# Altium schematic sheet 02 BLOCK.SchDoc
size 420 x 297 mm
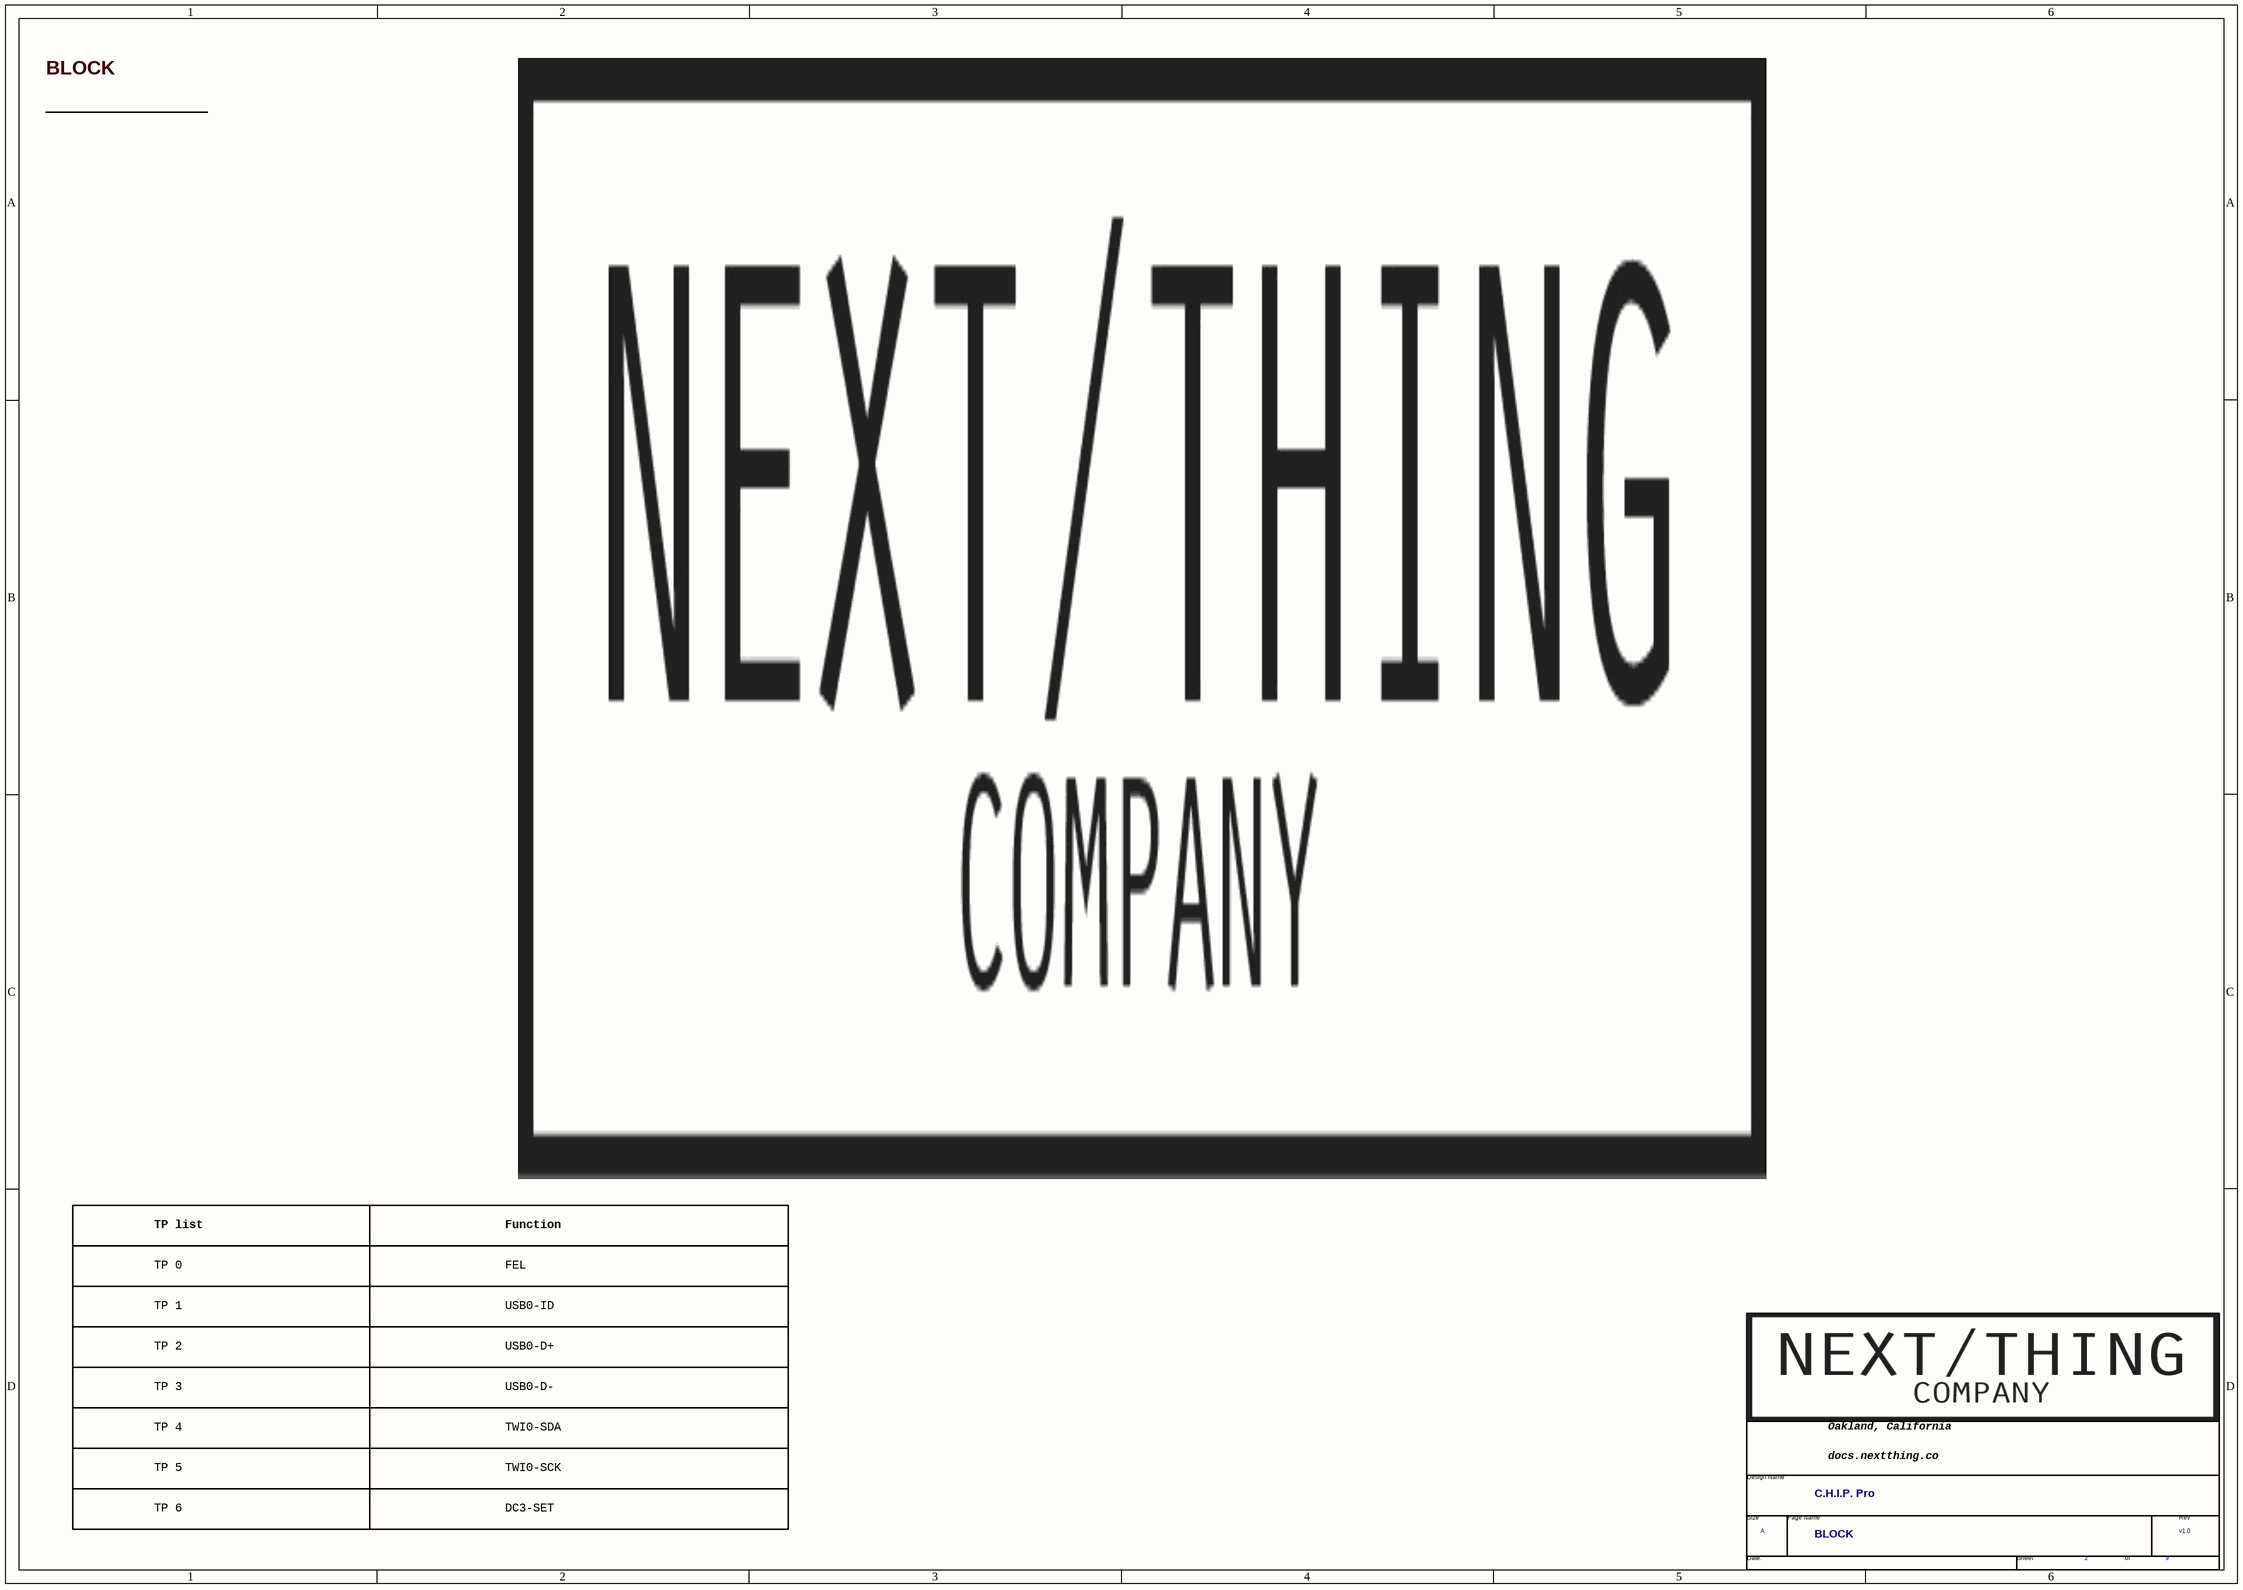
[diagram p0: 02 BLOCK.SchDoc]

## Parts
*  Page Count: 9  Page Number: 2  Page Size: A  Title: C.H.I.P. Pro  RevCode: v1.0  Doc: BLOCK  (hidden comment: TitleBlock1-nextthing)  (graphical)

## Notes on the sheet
- BLOCK
- TP list
- TP 0
- Function
- FEL
- TP 1
- USB0-ID
- TP 2
- TP 3
- USB0-D+
- USB0-D-
- TP 4
- TP 5
- TWI0-SDA
- TWI0-SCK
- TP 6
- DC3-SET
- (in symbol TitleBlock1-nextthing) Oakland, California; Design Name; docs.nextthing.co /; Size; Page Name; Rev; Date:; Sheet; of

## Library data of the parts
* = TitleBlock1-nextthing: Page Create Date: March  8, 1995